# Altium schematic sheet schematic.SchDoc
size A3; PageSetup: Record=PageOptions|CenterHorizontal=True|CenterVertical=True|PrintScale=0.73|XCorrection=1.00|YCorrection=1.00|PrintKind=1|BorderSize=5000000|LeftOffset=0|BottomOffset=0|Orientation=2|PaperLength=2970|PaperWidth=2100|Scale=100|PaperSource=7|PrintQuality=300|MediaType=1|DitherType=10|PrintScaleMode=1|PaperKind=A4|PaperIndex=9
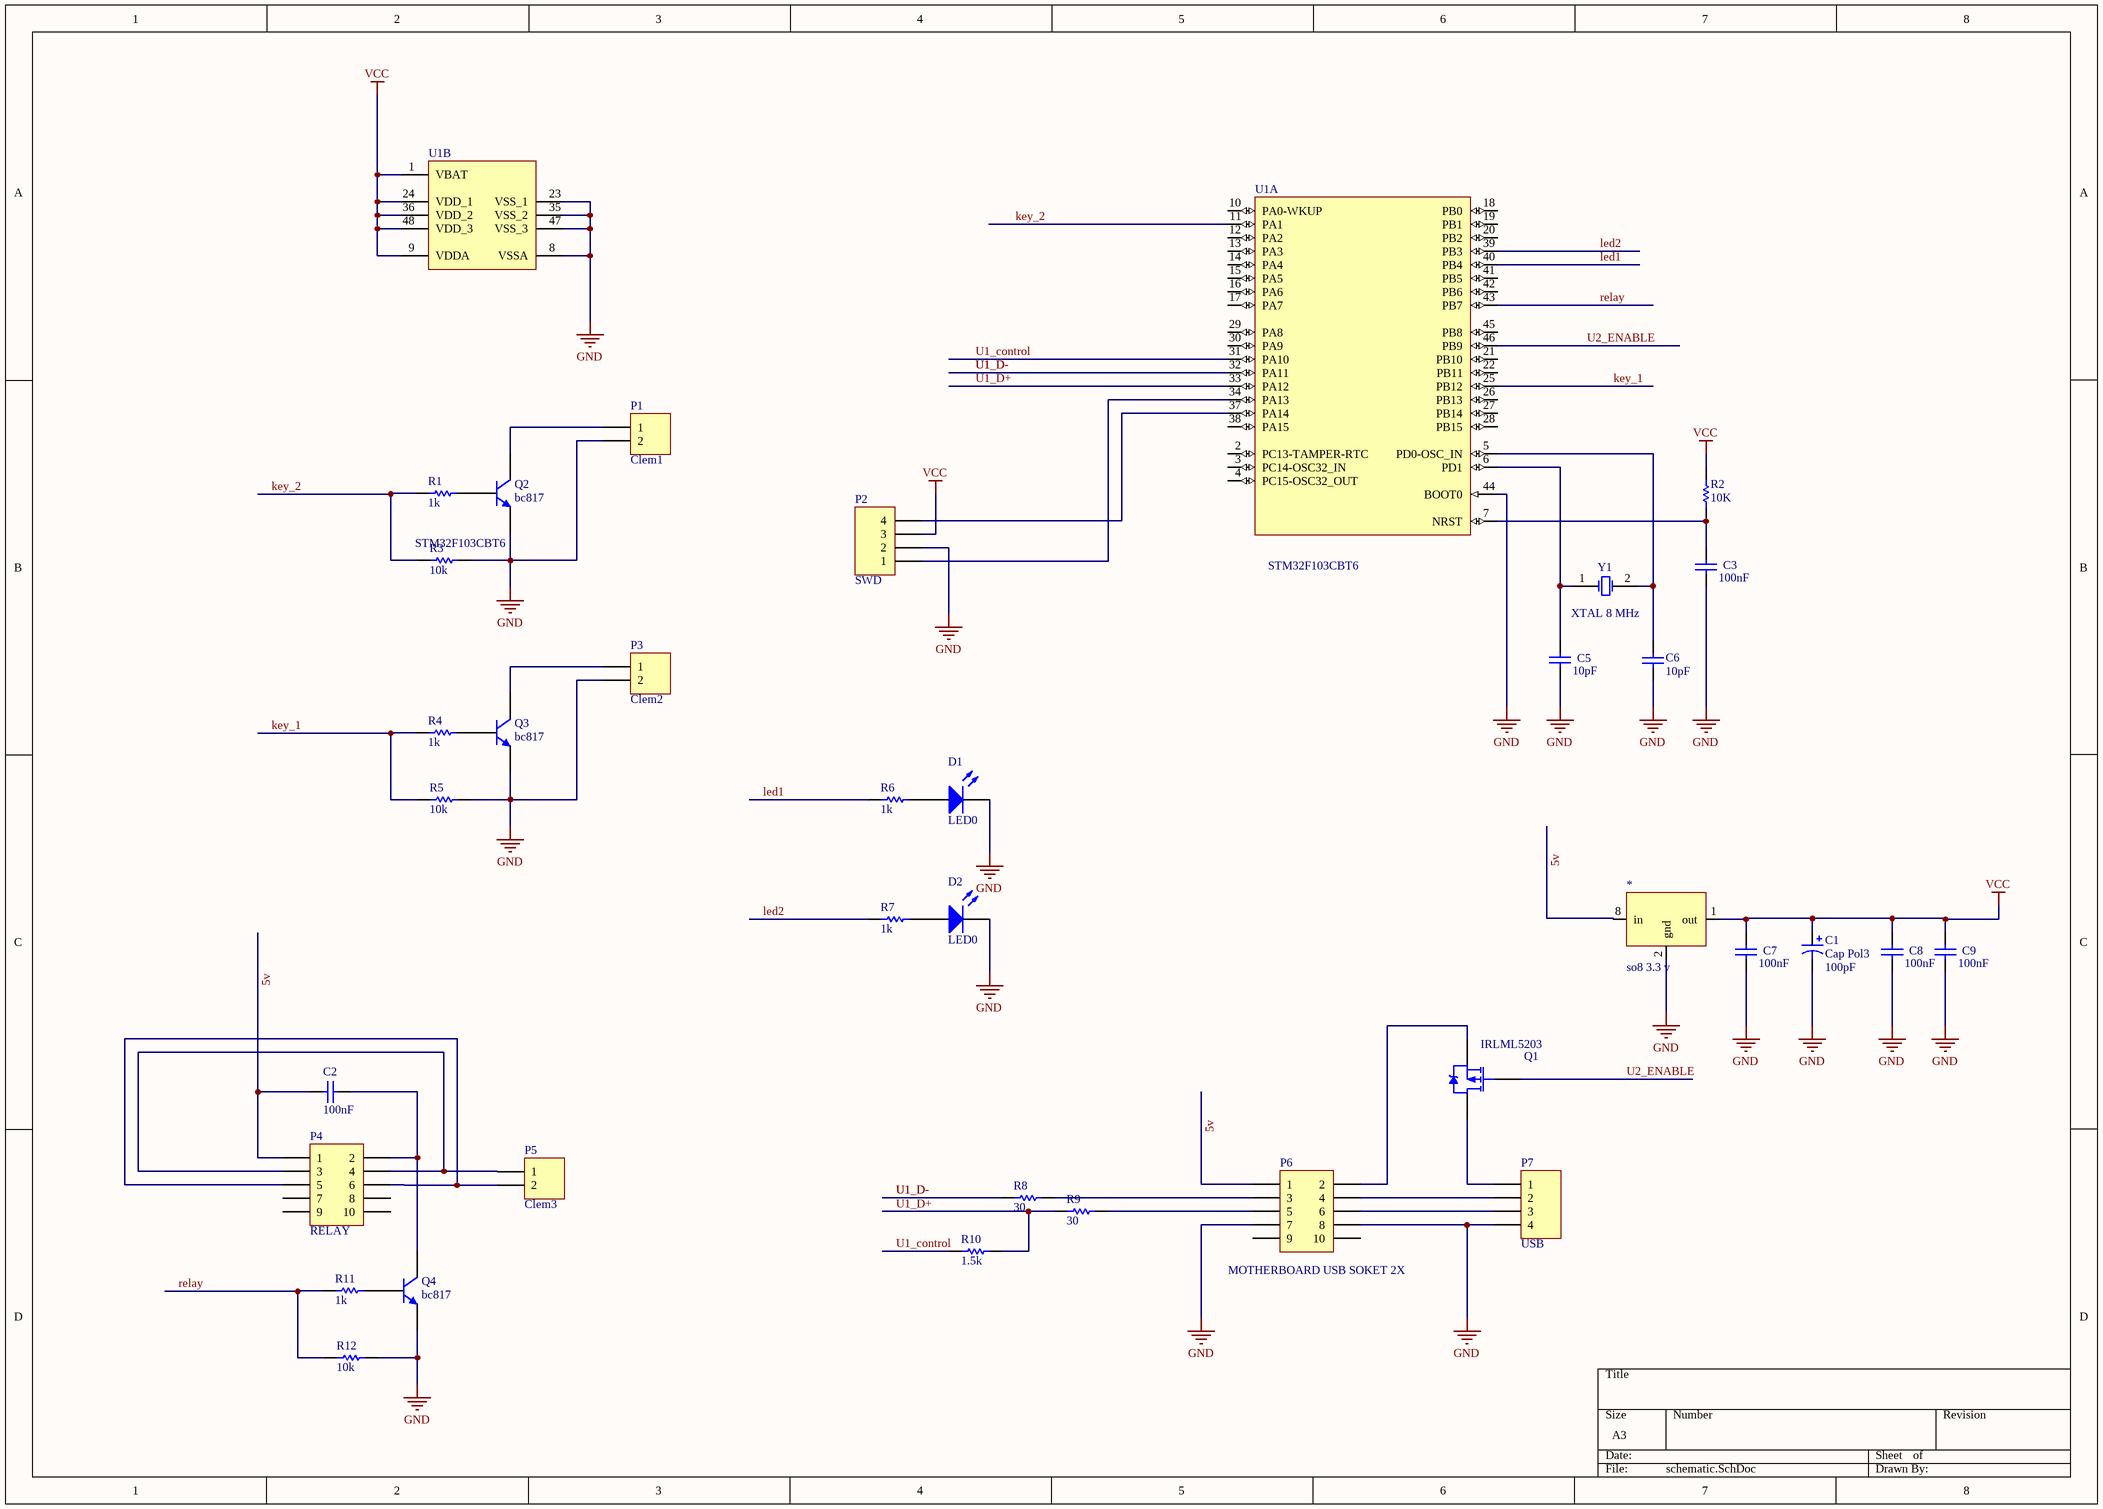
[diagram p0: schematic.SchDoc]

## Parts
*  so8 3.3 v  [SO8_N]
C1  Cap Pol3  value 100pF  [1812]
C2  100nF  [1-0805_N]
C3  100nF  [1-0805_N]
C5  10pF  [1-0805_N]
C6  10pF  [1-0805_N]
C7  100nF  [1-0805_N]
C8  100nF  [1-0805_N]
C9  100nF  [1-0805_N]
D1  LED0  [1-0805_N]
D2  LED0  [1-0805_N]
P1  Clem1  [HDR1X2]
P2  SWD  [MHDR1X4]
P3  Clem2  [HDR1X2]
P4  RELAY  [relay 5v]
P5  Clem3  [klemnik]
P6  MOTHERBOARD USB SOKET 2X  [MB_USB]
P7  USB  [USB_SOCKET]
Q1  IRLML5203  [SOT23_N]
Q2  bc817  [SOT23_N]
Q3  bc817  [SOT23_N]
Q4  bc817  [SOT23_N]
R1  1k  [1-0805_N]
R2  10K  [1-0805_N]
R3  10k  [1-0805_N]
R4  1k  [1-0805_N]
R5  10k  [1-0805_N]
R6  1k  [1-0805_N]
R7  1k  [1-0805_N]
R8  30  [1-0805_N]
R9  30  [1-0805_N]
R10  1.5k  [1-0805_N]
R11  1k  [1-0805_N]
R12  10k  [1-0805_N]
U1  STM32F103CBT6  [LQFP48_N]  (parts A,B of 2)
Y1  XTAL 8 MHz  [QUARTZ]

## Nets
GND: *.2(gnd) C1.2 C3.1 C5.1 C6.1 C7.1 C8.1 C9.1 D1.2(K) D2.2(K) P1.2 P2.2 P3.2 P6.7 P6.8 P7.4 Q2.2(E) Q3.2(E) Q4.2(E) R3.2 R5.2 R12.2 U1.8(VSSA) U1.23(VSS_1) U1.35(VSS_2) U1.44(BOOT0) U1.47(VSS_3)
VCC: *.1(out) C1.1 C7.2 C8.2 C9.2 P2.3 R2.2 U1.1(VBAT) U1.9(VDDA) U1.24(VDD_1) U1.36(VDD_2) U1.48(VDD_3)
5v: *.8(in) C2.1 P4.1 P6.1
key_1: R4.1 R5.1 U1.25(PB12)
key_2: R1.1 R3.1 U1.11(PA1)
led1: R6.1 U1.40(PB4)
led2: R7.1 U1.39(PB3)
relay: R11.1 R12.1 U1.43(PB7)
U1_control: R10.1 U1.31(PA10)
U1_D+: R9.1 R10.2 U1.33(PA12)
U1_D-: R8.1 U1.32(PA11)
U2_ENABLE: Q1.3(G) U1.46(PB9)
NetC2_2: C2.2 P4.2 Q4.1(C)
NetC3_2: C3.2 R2.1 U1.7(NRST)
NetC5_2: C5.2 U1.6(PD1) Y1.1(OSC1)
NetC6_2: C6.2 U1.5(PD0-OSC_IN) Y1.2(OSC2)
NetD1_1: D1.1(A) R6.2
NetD2_1: D2.1(A) R7.2
NetP1_1: P1.1 Q2.1(C)
NetP2_1: P2.1 U1.34(PA13)
NetP2_4: P2.4 U1.37(PA14)
NetP3_1: P3.1 Q3.1(C)
NetP4_3: P4.3 P4.4 P5.1
NetP4_5: P4.5 P4.6 P5.2
NetP6_2: P6.2 Q1.2(S)
NetP6_3: P6.3 R8.2
NetP6_4: P6.4 P7.2
NetP6_5: P6.5 R9.2
NetP6_6: P6.6 P7.3
NetP7_1: P7.1 Q1.1(D)
NetQ2_3: Q2.3(B) R1.2
NetQ3_3: Q3.3(B) R4.2
NetQ4_3: Q4.3(B) R11.2

Not connected (* = marked no-connect by the designer): P4 7 8 9 10; P6 9 10; U1 2(PC13-TAMPER-RTC) 3(PC14-OSC32_IN) 4(PC15-OSC32_OUT) 10(PA0-WKUP) 12(PA2) 13(PA3) 14(PA4) 15(PA5) 16(PA6) 17(PA7) 18(PB0) 19(PB1) 20(PB2) 21(PB10) 22(PB11) 26(PB13) 27(PB14) 28(PB15) 29(PA8) 30(PA9) 38(PA15) 41(PB5) 42(PB6) 45(PB8)

## Library data of the parts
C1 = Cap Pol3: Polarized Capacitor (Surface Mount); Published: 8-Jun-2000; LatestRevisionDate: 29-May-2009; LatestRevisionNote: IPC-7351 Footprint Added.; PackageReference: C0805; Publisher: Altium Limited; PackageDescription: Chip Capacitor
C2 = Cap: Capacitor; voltage: 30V; Published: 8-Jun-2000; LatestRevisionDate: 17-Jul-2002; LatestRevisionNote: Re-released for DXP Platform.; PackageReference: RAD-0.3; Publisher: Altium Limited; PackageDescription: Radial Cap, Thru-Hole; 2 Leads; 0.3 in Pin Spacing; Value: 100nF
C3 C5-C9 = Cap: Capacitor; Published: 8-Jun-2000; LatestRevisionDate: 17-Jul-2002; LatestRevisionNote: Re-released for DXP Platform.; PackageReference: RAD-0.3; Publisher: Altium Limited; PackageDescription: Radial Cap, Thru-Hole; 2 Leads; 0.3 in Pin Spacing
  C3 C7-C9: Value: 100nF
  C5 C6: Value: 10pF
D1 D2 = LED0: Typical INFRARED GaAs LED; Published: 8-Jun-2000; LatestRevisionDate: 08-Jul-2005; LatestRevisionNote: Mech Layer 1 removed.; PackageReference: LED-0; Publisher: Altium Limited; PackageDescription: LED; 2 Leads
P1 P3 = Header 2: Header, 2-Pin; LatestRevisionDate: 17-Jul-2002; LatestRevisionNote: Re-released for DXP Platform.; Publisher: Altium Limited
P2 P7 = MHDR1X4: Header, 4-Pin; LatestRevisionDate: 17-Jul-2002; LatestRevisionNote: Re-released for DXP Platform.; Publisher: Altium Limited
P4 P6 = Header 5X2: Header, 5-Pin, Dual row; LatestRevisionDate: 17-Jul-2002; LatestRevisionNote: Re-released for DXP Platform.; Publisher: Altium Limited
P5 = MHDR1X2: Header, 2-Pin; LatestRevisionDate: 17-Jul-2002; LatestRevisionNote: Re-released for DXP Platform.; Publisher: Altium Limited
Q1 = PMOS-2: P-Channel Power MOSFET; Note: Pin 4 not drawn and electrically connected to Pin 2.; Published: 8-Jun-2000; LatestRevisionDate: 17-Jul-2002; LatestRevisionNote: Re-released for DXP Platform.; DatasheetVersion: PD-9.390D; PackageVersion: Feb-1997; PackageReference: TO-220AB; Publisher: Altium Limited; PackageDescription: TO, Thru-Hole, Vertical, Heatsink Mounted; 3 In-Line Leads; Pitch 2.54 mm; ComponentLink1Description: Manufacturer Link; ComponentLink1URL: http://www.irf.com/
Q2-Q4 = 2N3904: NPN General Purpose Amplifier; Published: 8-Jun-2000; LatestRevisionDate: 15-Jan-2003; LatestRevisionNote: PCB Footprint 'BCY-W3/D4.7' replaced; DatasheetVersion: 1997; PackageVersion: Sep-1998; PackageReference: TO-92A; Publisher: Altium Limited; PackageDescription: TO, Flat Index; 3 In-Line, Axial Leads; Body Dia. 4.5mm; Leads 0.51 x 0.48 mm (max); ComponentLink1Description: Manufacturer Link; ComponentLink1URL: http://www.fairchildsemi.com/; ComponentLink2Description: Datasheet; ComponentLink2URL: http://www.fairchildsemi.com/ds/2N%2F2N3904.pdf
R1-R12 = Res1: Resistor; Published: 8-Jun-2000; LatestRevisionDate: 17-Jul-2002; LatestRevisionNote: Re-released for DXP Platform.; PackageReference: AXIAL-0.3; Publisher: Altium Limited; PackageDescription: Axial Device, Thru-Hole; 2 Leads; 0.3 in Pin Spacing
  R1 R4 R6 R7 R11: Value: 1k
  R2: Value: 10K
  R3 R5 R12: Value: 10k
  R8 R9: Value: 30
  R10: Value: 1.5k
U1 = STM32F103CBT6: STM32 ARM-based 32-bit MCU Performance Line with 128 kB Flash, 20 kB Internal RAM, -40 to +85°C Temperature, 48-Pin LQFP, Tray; DatasheetVersion: rev13.0, Apr-2011; PackageVersion: rev13, Apr-2011; PackageReference: LQFP48; PackageDescription: 48-Pin Low-Profile Quad Flat Pack, 7 x 7 mm Body, 0.5 mm Pitch (LQFP48); ComponentLink1Description: Manufacturer URL; ComponentLink1URL: http://www.st.com/; ComponentLink2Description: STM32F103 Datasheet; ComponentLink2URL: http://www.st.com/internet/com/TECHNICAL_RESOURCES/TECHNICAL_LITERATURE/DATASHEET/CD00161566.pdf; ComponentLink3Description: STM32 Family Web Page; ComponentLink3URL: www.st.com/stm32
Y1 = XTAL: Crystal Oscillator; Published: 8-Jun-2000; LatestRevisionDate: 17-Jul-2002; LatestRevisionNote: Re-released for DXP Platform.; PackageReference: R38; Publisher: Altium Limited; PackageDescription: Crystal, Thru-Hole; 2 Leads; Body 3.1 x 8.2 mm (Dia.xH)